# EAGLE design led ppm display w gp mirrored (EAGLE 6.5.0)
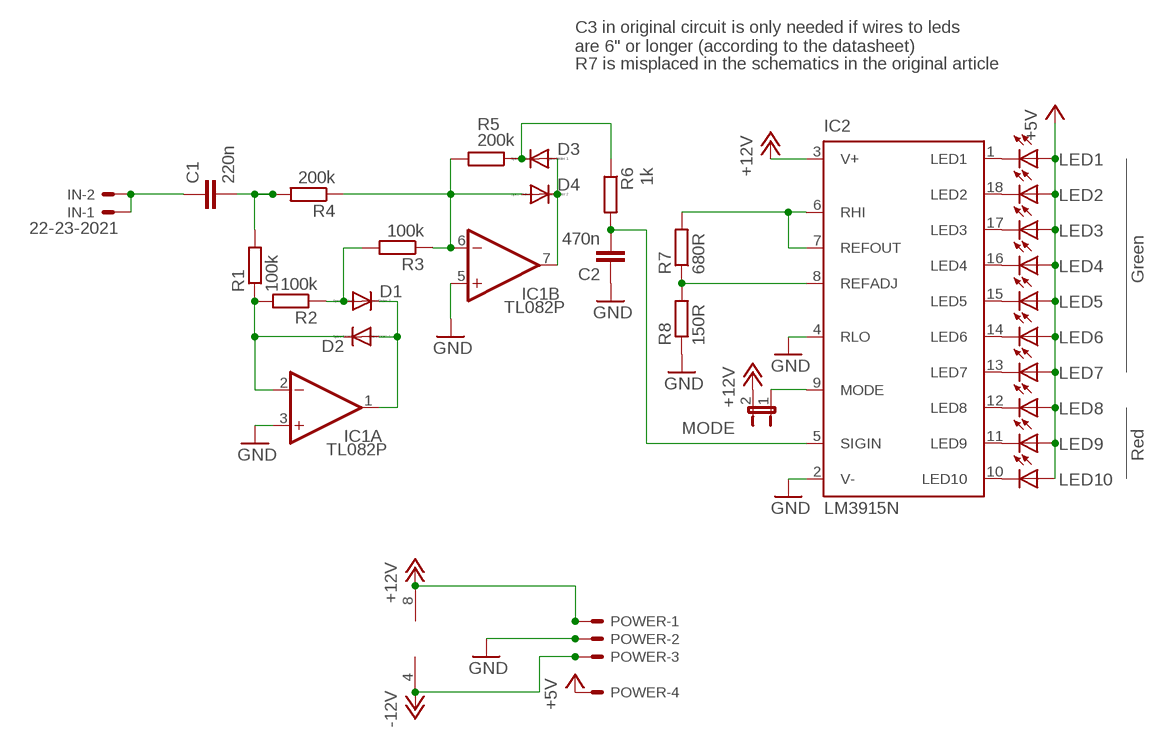
[diagram p0: schematic, sheet 1]

## Parts
C1  220n  C-EU050-025X075  [C050-025X075]
C2  470n  C-EU050-025X075  [C050-025X075]
D1  1N4148DOJ35-5  [DO35-5J]
D2  1N4148DOJ35-5  [DO35-5J]
D3  1N4148DOJ35-5  [DO35-5J]
D4  1N4148DOJ35-5  [DO35-5J]
IC1  TL082P  [DIL08]
IC2  LM3915N  [DIL18]
IN  22-23-2021  [22-23-2021]
LED1  LED3MM  [LED3MM]
LED2  LED3MM  [LED3MM]
LED3  LED3MM  [LED3MM]
LED4  LED3MM  [LED3MM]
LED5  LED3MM  [LED3MM]
LED6  LED3MM  [LED3MM]
LED7  LED3MM  [LED3MM]
LED8  LED3MM  [LED3MM]
LED9  LED3MM  [LED3MM]
LED10  LED3MM  [LED3MM]
MODE  JP1E  [JP1]
POWER  KK-156-4  [KK-156-4]
R1  100k  R-EU_0207/7  [0207/7]
R2  100k  R-EU_0207/7  [0207/7]
R3  100k  R-EU_0207/7  [0207/7]
R4  200k  R-EU_0207/7  [0207/7]
R5  200k  R-EU_0207/7  [0207/7]
R6  1k  R-EU_0207/7  [0207/7]
R7  680R  R-EU_0207/7  [0207/7]
R8  150R  R-EU_0207/7  [0207/7]

## Nets
+5V: LED1.A LED2.A LED3.A LED4.A LED5.A LED6.A LED7.A LED8.A LED9.A LED10.A POWER.4
+12V: IC1.8(P:V+) IC2.3(V+) MODE.2 POWER.1
-12V: IC1.4(P:V-) POWER.3
GND: C2.1 IC1.3(A:+IN) IC1.5(B:+IN) IC2.2(V-) IC2.4(RLO) POWER.2 R8.1
MODE: IC2.9(MODE) MODE.1
N$1: D1.A R2.1 R3.2
N$2: D2.C IC1.2(A:-IN) R1.1 R2.2
N$3: D1.C D2.A IC1.1(A:OUT)
N$4: D4.A IC1.6(B:-IN) R3.1 R4.1 R5.2
N$5: D3.C R5.1 R6.1
N$6: C1.2 R1.2 R4.2
N$7: D3.A D4.C IC1.7(B:OUT)
N$8: C2.2 IC2.5(SIGIN) R6.2
N$9: IC2.6(RHI) IC2.7(REFOUT) R7.2
N$11: IC2.1(LED1) LED1.K(C)
N$12: IC2.18(LED2) LED2.K(C)
N$13: IC2.17(LED3) LED3.K(C)
N$14: IC2.16(LED4) LED4.K(C)
N$15: IC2.15(LED5) LED5.K(C)
N$16: IC2.14(LED6) LED6.K(C)
N$17: IC2.13(LED7) LED7.K(C)
N$18: IC2.12(LED8) LED8.K(C)
N$19: IC2.11(LED9) LED9.K(C)
N$20: IC2.10(LED10) LED10.K(C)
N$21: IC2.8(REFADJ) R7.1 R8.2
N$22: C1.1 IN.1 IN.2

## Notes on the sheet
- C3 in original circuit is only needed if wires to leds 
  are 6" or longer (according to the datasheet)
- R7 is misplaced in the schematics in the original article
- Green
- Red

## Library data of the parts
C1 C2 = resistor:C-EU: CAPACITOR, European symbol
D1-D4 = joakim:1N4148: DIODE high speed (Philips)
IC1 = linear:TL082: OP AMP Data sheet <http://www.ti.com/lit/ds/symlink/tl084a . pdf>; DATA_SHEET: <a href="http://www.ti.com/lit/ds/symlink/tl084a.pdf"> Data sheet </a>
IC2 = national-semiconductor:LM391: Dot/Bar Display Driver Source: Data sheet LM3915 <http://www.national.com/ds/LM/LM3915.pdf> Data sheet LM3914 <http://www.national.com/ds/LM/LM3914.pdf>
IN = con-molex:22-23-2021: .100" (2.54mm) Center Header - 2 Pin; MF: MOLEX; MPN: 22-23-2021; OC_FARNELL: 1462926; OC_NEWARK: 25C3832
LED1-LED10 = led:LED: LED OSRAM: - CHIPLED LG R971, LG N971, LY N971, LG Q971, LY Q971, LO R971, LY R971 LH N974, LH R974 LS Q976, LO Q976, LY Q976 LO Q996 - Hyper CHIPLED LW Q18S LB Q993, LB Q99A, LB R99A - SideLED LS A670, LO A670, LY A670, LG A670, LP A670 LB A673, LV A673, LT A673, LW A673 LH A674 LY A675 LS A676, LA A676, LO A676, LY A676, LW A676 LS A679, LY A679, LG A679 - Hyper Micro SIDELED® LS Y876, LA Y876, LO Y876, LY Y876 LT Y87S - SmartLED LW L88C, LW L88S LB L89C, LB L89S, LG L890 LS L89K, LO L89K, LY L89K LS L896, LA L896, LO L896, LY L896 - TOPLED LS T670, LO T670, LY T670, LG T670, LP T670 LSG T670, LSP T670, LSY T670, LOP T670, LYG T670 LG T671, LOG T671, LSG T671 LB T673, LV T673, LT T673, LW T673 LH T674 LS T676, LA T676, LO T676, LY T676, LB T676, LH T676, LSB T676, LW T676 LB T67C, LV T67C, LT T67C, LS T67K, LO T67K, LY T67K, LW E67C LS E67B, LA E67B, LO E67B, LY E67B, LB E67C, LV E67C, LT E67C LW T67C LS T679, LY T679, LG T679 LS T770, LO T770, LY T770, LG T770, LP T770 LB T773, LV T773, LT T773, LW T773 LH T774 LS E675, LA E675, LY E675, LS T675 LS T776, LA T776, LO T776, LY T776, LB T776 LHGB T686 LT T68C, LB T68C - Hyper Mini TOPLED® LB M676 - Mini TOPLED Santana® LG M470 LS M47K, LO M47K, LY M47K Source: http://www.osram.convergy.de LUXEON: - LUMILED® LXK2-PW12-R00, LXK2-PW12-S00, LXK2-PW14-U00, LXK2-PW14-V00 LXK2-PM12-R00, LXK2-PM12-S00, LXK2-PM14-U00 LXK2-PE12-Q00, LXK2-PE12-R00, LXK2-PE12-S00, LXK2-PE14-T00, LXK2-PE14-U00 LXK2-PB12-K00, LXK2-PB12-L00, LXK2-PB12-M00, LXK2-PB14-N00, LXK2-PB14-P00, LXK2-PB14-Q00 LXK2-PR12-L00, LXK2-PR12-M00, LXK2-PR14-Q00, LXK2-PR14-R00 LXK2-PD12-Q00, LXK2-PD12-R00, LXK2-PD12-S00 LXK2-PH12-R00, LXK2-PH12-S00 LXK2-PL12-P00, LXK2-PL12-Q00, LXK2-PL12-R00 Source: www.luxeon.com KINGBRIGHT: KA-3528ASYC Source: www.kingbright.com
MODE = jumper:JP1E: JUMPER
POWER = con-molex:KK-156-4: KK 156 HEADER Source: http://www.molex.com/pdm_docs/sd/026604100_sd.pdf; OC_FARNELL: unknown; OC_NEWARK: unknown
R1-R8 = resistor:R-EU_: RESISTOR, European symbol

## Board
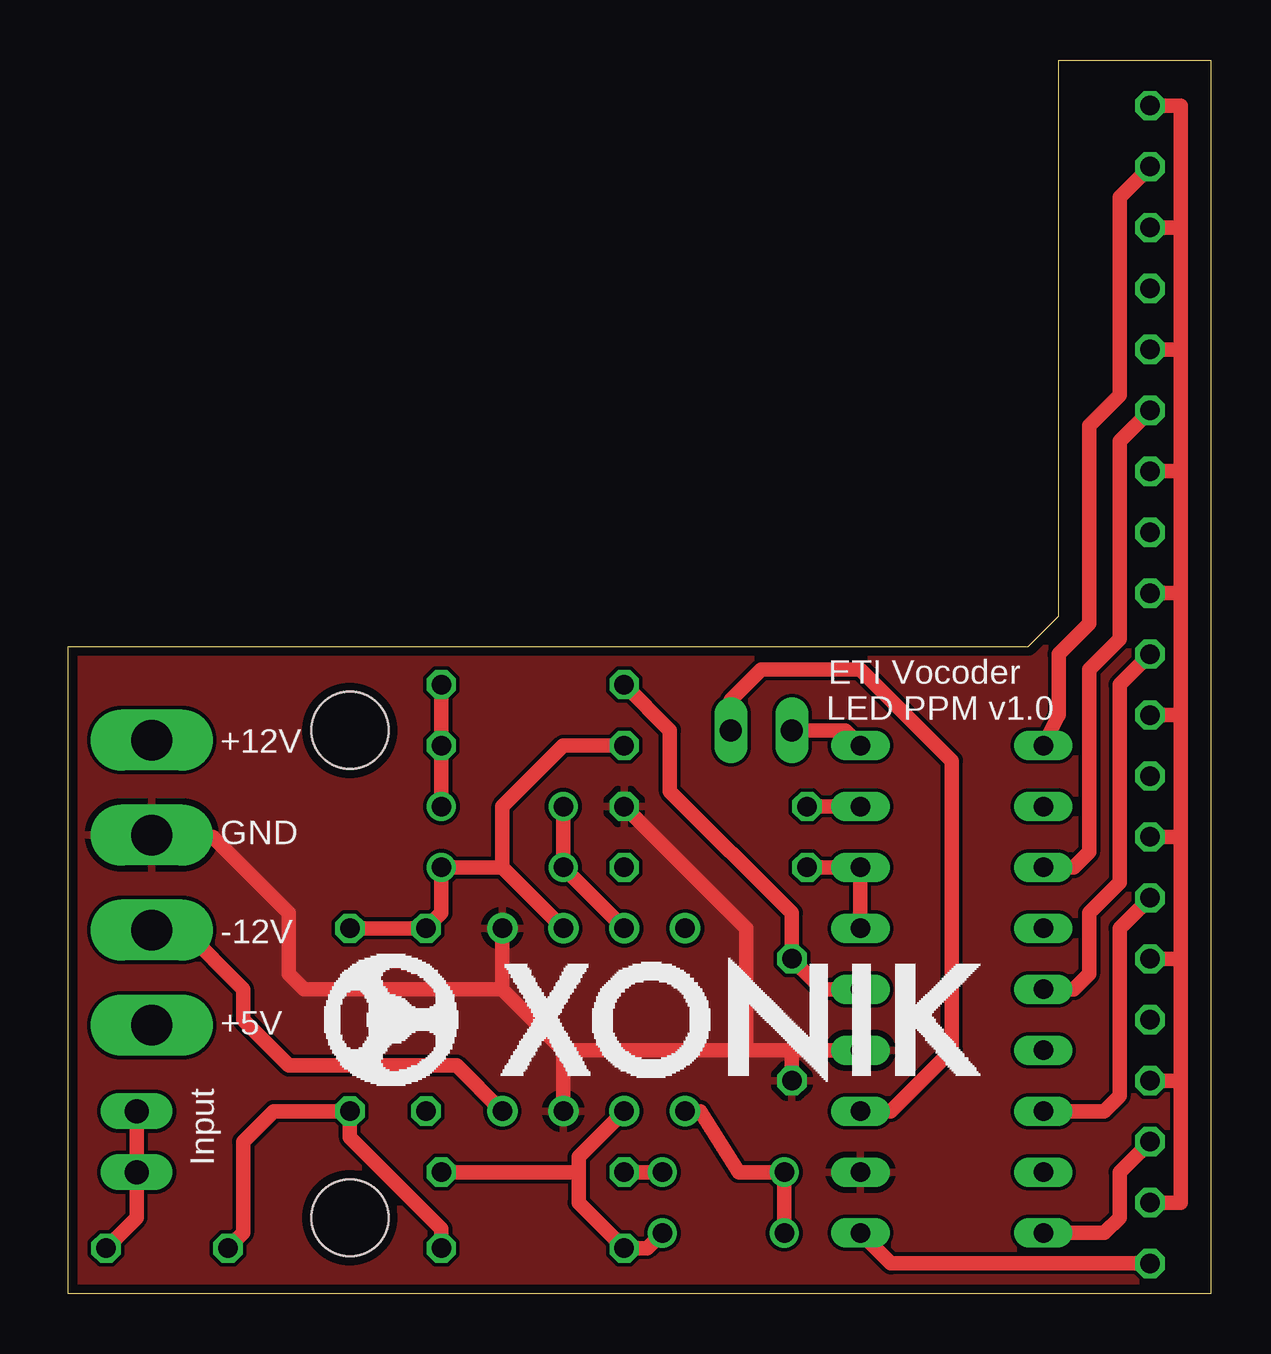
[diagram p1: board, top side]
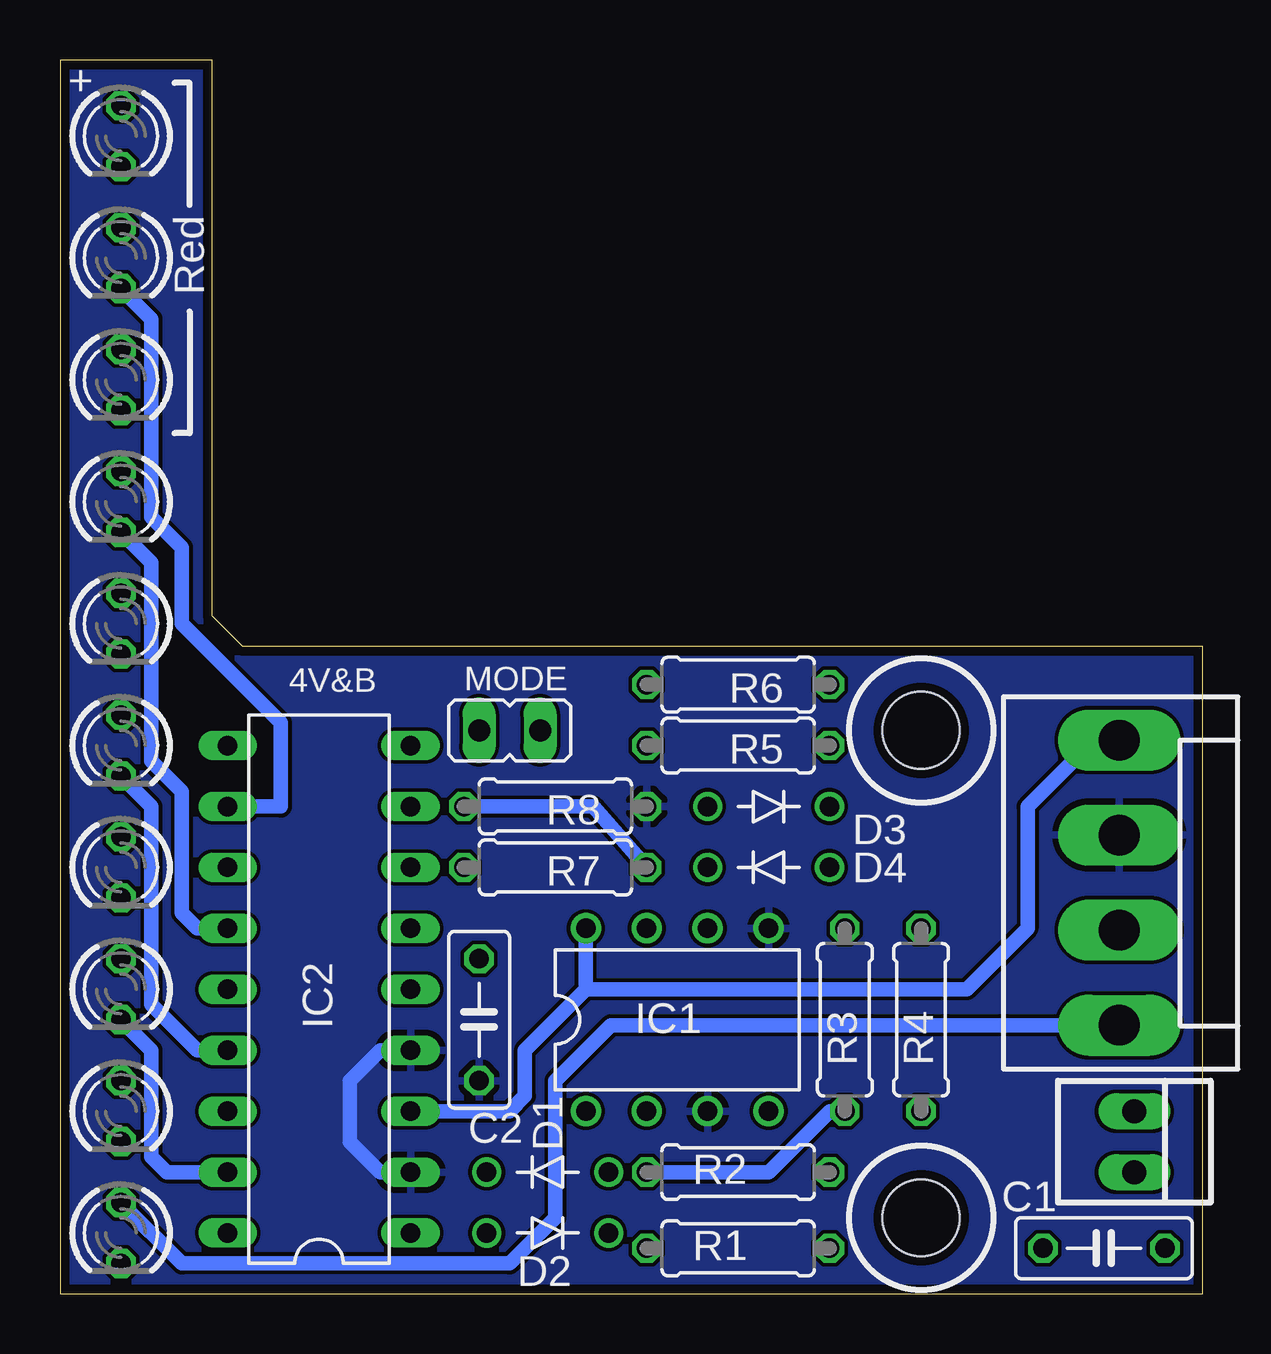
[diagram p2: board, bottom side, seen from below]

Size 47.61 x 51.44 mm. Coordinates in mm from the lower left corner, seen from the top.
Outline: 47.61,0 0,0 0,26.98 1.57,26.99 39.99,26.99 41.26,28.26 41.26,51.44 41.27,51.42 47.61,51.42 47.61,0
Copper layers (1*16): Top 0.0356mm / dielectric 1.5011mm / Bottom 0.0356mm
Design rules "oshpark-2layer": minimum track width 6mil, minimum drill 13mil, track to track 6mil, track to pad 6mil, pad to pad 6mil, via to via 6mil, smd to smd 6mil, copper to edge 15mil, drill to drill 6mil, minimum pad ring 7mil, minimum via ring 7mil, stop-mask expansion 2.5mil, vias tented up to drill 0mil, thermal gap 10mil
Holes 3.2 mm at 11.74,3.17 11.74,23.5

### Footprints (pad centres in the part's own frame; a part is rotated, then mirrored left to right if it is on the bottom)
C050-025X075 = drill 0.813 octagon: 1 -2.54,0; 2 2.54,0
DO35-5J = drill 0.813: A 2.54,0; C -2.54,0
DIL08 = drill 0.813 pad 1.27: 1 -3.81,-3.81; 2 -1.27,-3.81; 3 1.27,-3.81; 4 3.81,-3.81; 5 3.81,3.81; 6 1.27,3.81; 7 -1.27,3.81; 8 -3.81,3.81
DIL18 = drill 0.813 long: 1 -10.16,-3.81; 2 -7.62,-3.81; 3 -5.08,-3.81; 4 -2.54,-3.81; 5 0,-3.81; 6 2.54,-3.81; 7 5.08,-3.81; 8 7.62,-3.81; 9 10.16,-3.81; 10 10.16,3.81; 11 7.62,3.81; 12 5.08,3.81; 13 2.54,3.81; 14 0,3.81; 15 -2.54,3.81; 16 -5.08,3.81; 17 -7.62,3.81; 18 -10.16,3.81
22-23-2021 = drill 1 long: 1 -1.27,0; 2 1.27,0
LED3MM = drill 0.813 octagon: A -1.27,0; K 1.27,0
JP1 = drill 0.914 long: 1 0,-1.27; 2 0,1.27
KK-156-4 = drill 1.7 pad 2.184 long: 1 -5.94,0; 2 -1.98,0; 3 1.98,0; 4 5.94,0
0207/7 = drill 0.813 octagon: 1 -3.81,0; 2 3.81,0

### Placement (x,y rotation side)
C1  4.12,1.91 180 bottom
C2  30.15,11.43 90 bottom
D1  27.29,5.08 0 bottom
D2  27.29,2.54 180 bottom
D3  18.09,20.32 180 bottom
D4  18.09,17.78 0 bottom
IC1  21.89,11.43 0 bottom
IC2  36.82,12.7 90 bottom
IN  2.84,6.35 270 bottom
LED1  45.07,2.54 270 bottom
LED2  45.07,7.62 270 bottom
LED3  45.07,12.7 270 bottom
LED4  45.07,17.78 270 bottom
LED5  45.07,22.86 270 bottom
LED6  45.07,27.94 270 bottom
LED7  45.07,33.02 270 bottom
LED8  45.07,38.1 270 bottom
LED9  45.07,43.18 270 bottom
LED10  45.07,48.26 270 bottom
MODE  28.88,23.5 270 bottom
POWER  3.48,17.14 270 bottom
R1  19.36,1.91 0 bottom
R2  19.36,5.08 0 bottom
R3  14.91,11.43 270 bottom
R4  11.74,11.43 270 bottom
R5  19.36,22.86 180 bottom
R6  19.36,25.4 180 bottom
R7  26.98,17.78 180 bottom
R8  26.98,20.32 180 bottom

### Tracks (layer width: path | path; a pad name or v marks a point on that pad's centre or on a via)
+5V
  Top 0.61: LED10.A 46.34,49.53 46.34,44.45 | 46.34,44.45 46.34,39.37 | 46.34,39.37 46.34,34.29 | 46.34,34.29 46.34,29.21 | 46.34,29.21 46.34,24.13 | 46.34,24.13 46.34,19.05 | 46.34,19.05 46.34,13.97 | 46.34,13.97 46.34,8.89 | 46.34,8.89 46.34,3.81 LED1.A | LED2.A 46.34,8.89 | LED3.A 46.34,13.97 | LED4.A 46.34,19.05 | LED5.A 46.34,24.13 | LED6.A 46.34,29.21 | LED7.A 46.34,34.29 | LED8.A 46.34,39.37 | LED9.A 46.34,44.45
  Bottom 0.61: POWER.4 24.66,11.21 26.98,8.89 26.98,3.17 28.88,1.27 42.53,1.27 LED1.A
+12V
  Top 0.61: IC2.3 34.28,7.62 36.82,10.16 36.82,22.23 33.01,26.04 28.88,26.04 27.61,24.77 MODE.2
  Bottom 0.61: IC2.3 28.88,7.62 28.25,8.26 28.25,10.16 25.71,12.7 | 25.71,12.7 IC1.8 | POWER.1 4.52,23.09 7.29,20.32 7.29,15.24 9.83,12.7 25.71,12.7
-12V
  Top 0.61: POWER.3 4.83,15.16 7.29,12.7 7.29,11.43 9.19,9.53 16.18,9.53 IC1.4
GND
  Top 0.61: IC2.4 30.15,10.16 | C2.1 30.15,10.16 | 30.15,10.16 28.25,10.16 | 28.25,10.16 20.62,10.16 | 20.62,10.16 IC1.3 | 18.09,12.7 20.62,10.16 | IC1.5 18.09,12.7 | 18.09,12.7 9.83,12.7 9.19,13.34 9.19,15.88 6.02,19.05 3.55,19.05 POWER.2 | R8.1 28.25,15.24 28.25,10.16
  Bottom 0.61: IC2.2 34.28,5.08 35.55,6.35 35.55,8.89 34.28,10.16 IC2.4
  pour Bottom: 48.46,52.15 -0.73,52.15 -0.73,-0.68 48.37,-0.68 48.46,51.9
  pour Top: 49.05,53 49.14,52.66 49.05,-1.52 -0.13,-1.52 -0.13,53.25 49.14,53.25
MODE
  Top 0.61: IC2.9 32.37,23.5 MODE.1
N$1
  Top 0.61: D1.A R2.1
  Bottom 0.61: R2.1 18.09,5.08 15.54,7.62 R3.2
N$2
  Top 0.61: IC1.2 21.26,5.71 21.26,5.08 | 21.26,5.08 21.26,3.81 R1.1 24.12,1.91 D2.C | R2.2 21.26,5.08
N$3
  Top 0.61: D2.A D1.C 27.93,5.08 26.34,7.62 IC1.1
N$4
  Top 0.61: IC1.6 18.09,17.78 | 18.09,17.78 18.09,20.32 20.62,22.86 R5.2 | 18.09,17.78 D4.A 15.54,15.88 R3.1 R4.1
N$5
  Top 0.61: R6.1 R5.1 D3.C
N$6
  Top 0.61: R1.2 15.54,2.71 11.74,6.52 R4.2 8.56,7.62 7.29,6.35 7.29,2.54 C1.2
N$7
  Top 0.61: IC1.7 D4.C D3.A
N$8
  Top 0.61: IC2.5 31.42,12.7 C2.2 30.15,15.88 25.07,20.95 25.07,23.5 R6.2
N$9
  Top 0.61: IC2.6 IC2.7 R7.2
N$11
  Top 0.61: LED1.K 34.28,1.27 IC2.1
N$12
  Top 0.61: LED2.K 43.8,5.08 43.8,3.17 43.17,2.54 IC2.18
N$13
  Bottom 0.61: LED3.K 43.8,10.16 43.8,5.71 43.17,5.08 IC2.17
N$14
  Top 0.61: LED4.K 43.8,15.24 43.8,8.26 43.17,7.62 IC2.16
N$15
  Bottom 0.61: LED5.K 43.8,20.32 43.8,12.06 41.9,10.16 IC2.15
N$16
  Top 0.61: LED6.K 43.8,25.4 43.8,17.14 42.53,15.88 42.53,13.34 41.9,12.7 IC2.14
N$17
  Bottom 0.61: LED7.K 43.8,30.48 43.8,22.23 42.53,20.95 42.53,15.88 41.9,15.24 IC2.13
N$18
  Top 0.61: LED8.K 43.8,35.56 43.8,27.3 42.53,26.04 42.53,18.41 41.9,17.78 IC2.12
N$19
  Bottom 0.61: LED9.K 43.8,40.64 43.8,32.38 42.53,31.11 42.53,27.94 38.4,23.81 38.4,20.32 IC2.11
N$20
  Top 0.61: LED10.K 43.8,45.72 43.8,37.47 42.53,36.2 42.53,27.94 41.26,26.67 41.26,24.13 IC2.10
N$21
  Top 0.61: IC2.8 R8.2
  Bottom 0.61: R8.2 25.39,20.32 R7.1
N$22
  Top 0.61: C1.1 2.84,3.17 IN.2 IN.1

### Text on the board
bPlace: 4V&B
tNames: ETI Vocoder | LED PPM v1.0 | +12V | GND | -12V | +5V | Input
bNames: + | Red